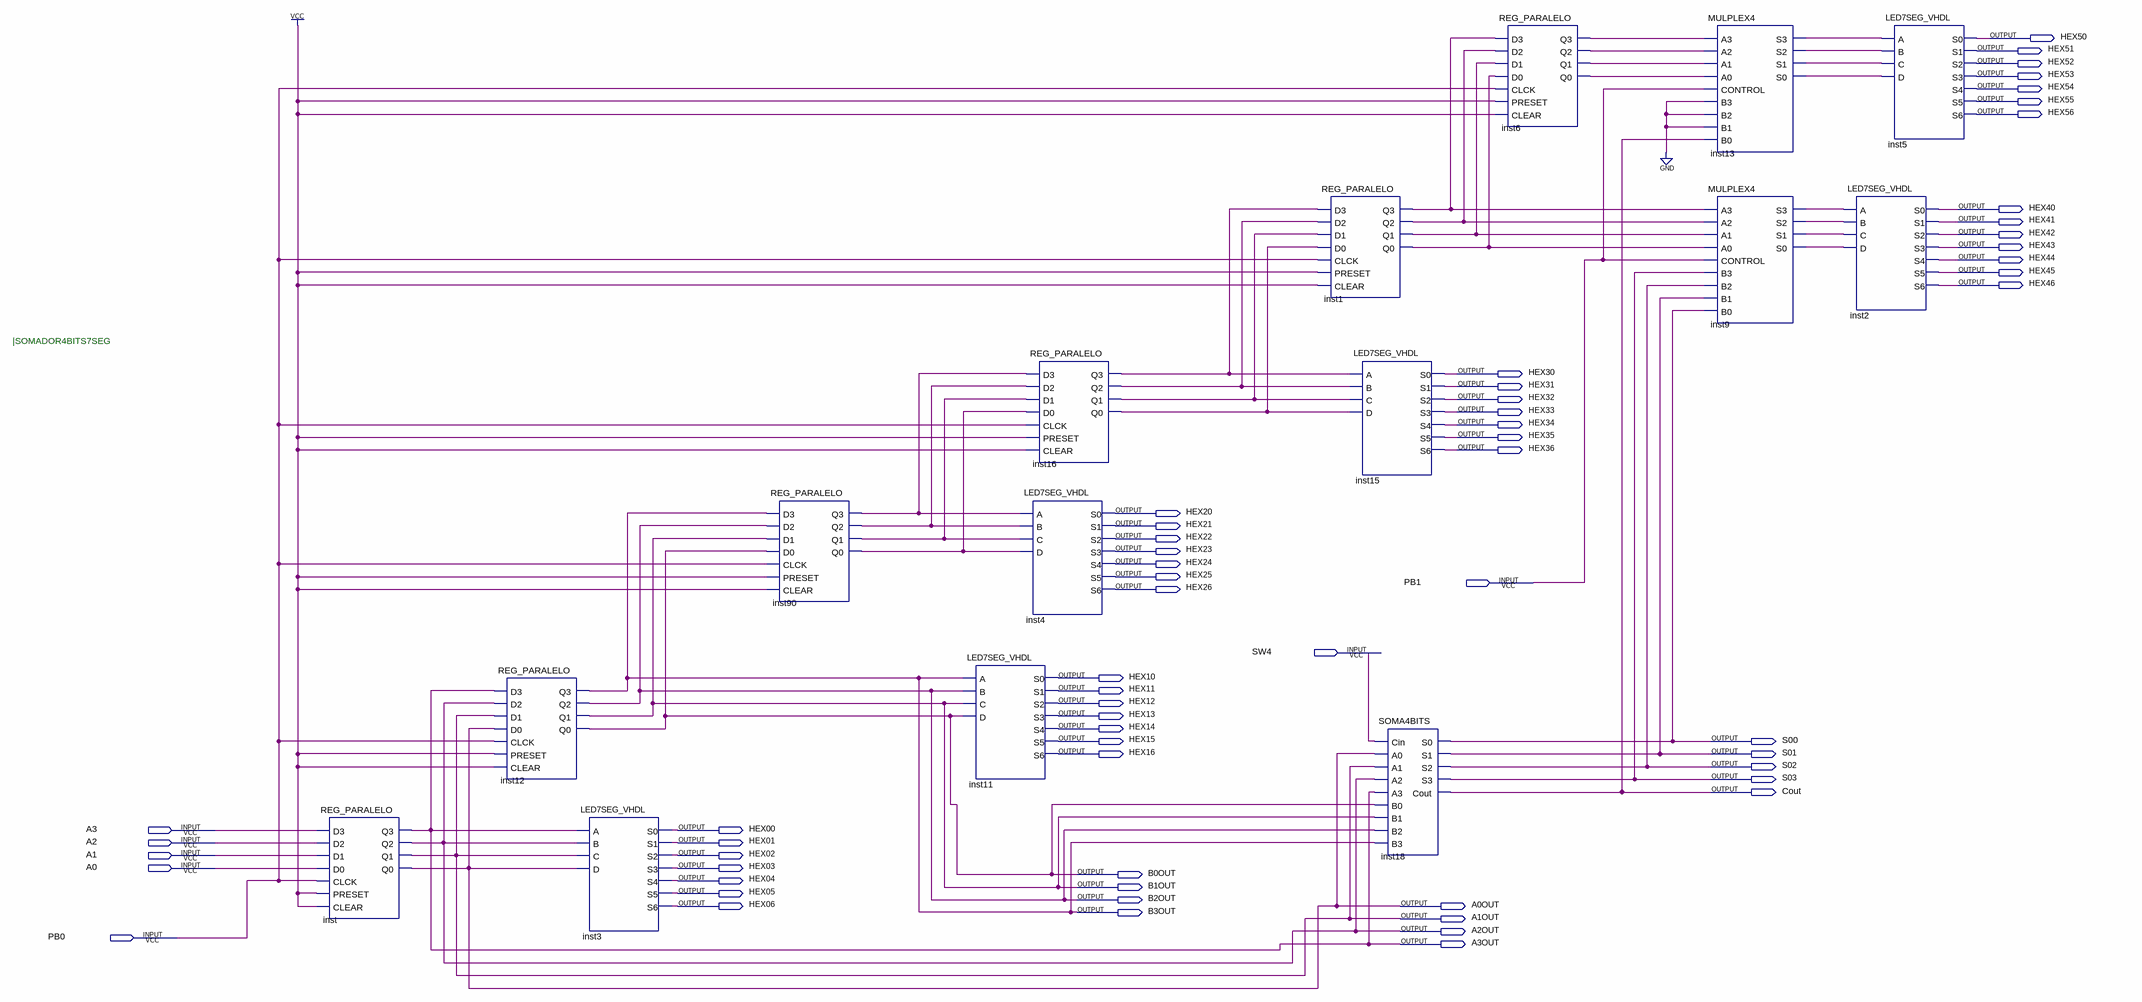
[diagram p0: schematic sheet]
// Quartus schematic SOMADOR4BITS7SEG.bdf as structural Verilog: 15 symbols, 62 pins
module SOMADOR4BITS7SEG (
  input  PB1,
  input  SW4,
  input  A3,
  input  A2,
  input  A1,
  input  A0,
  input  PB0,
  output HEX50,
  output HEX51,
  output HEX52,
  output HEX53,
  output HEX54,
  output HEX55,
  output HEX56,
  output HEX40,
  output HEX41,
  output HEX42,
  output HEX43,
  output HEX44,
  output HEX45,
  output HEX46,
  output HEX30,
  output HEX31,
  output HEX32,
  output HEX33,
  output HEX34,
  output HEX35,
  output HEX36,
  output HEX20,
  output HEX21,
  output HEX22,
  output HEX23,
  output HEX24,
  output HEX25,
  output HEX26,
  output HEX10,
  output HEX11,
  output HEX12,
  output HEX13,
  output HEX14,
  output HEX15,
  output S00,
  output HEX16,
  output S01,
  output S02,
  output S03,
  output Cout,
  output HEX00,
  output HEX01,
  output HEX02,
  output HEX03,
  output B0OUT,
  output HEX04,
  output B1OUT,
  output HEX05,
  output B2OUT,
  output HEX06,
  output A0OUT,
  output B3OUT,
  output A1OUT,
  output A2OUT,
  output A3OUT
);

  wire inst1_q0, inst1_q1, inst1_q2, inst1_q3, inst6_q0, inst6_q1, inst6_q2, inst6_q3, inst9_s0, inst9_s1,
       inst9_s2, inst9_s3, inst13_s0, inst13_s1, inst13_s2, inst13_s3, inst16_q0, inst16_q1, inst16_q2,
       inst16_q3, inst90_q0, inst90_q1, inst90_q2, inst90_q3;

  REG_PARALELO inst (
    .D3(A3), .D2(A2), .D1(A1), .D0(A0), .CLCK(PB0), .PRESET(1'b1), .CLEAR(1'b1), .Q3(A3OUT), .Q2(A2OUT),
    .Q1(A1OUT), .Q0(A0OUT));
  REG_PARALELO inst12 (
    .D3(A3OUT), .D2(A2OUT), .D1(A1OUT), .D0(A0OUT), .CLCK(PB0), .PRESET(1'b1), .CLEAR(1'b1), .Q3(B3OUT),
    .Q2(B2OUT), .Q1(B1OUT), .Q0(B0OUT));
  LED7SEG_VHDL inst3 (
    .A(A3OUT), .B(A2OUT), .C(A1OUT), .D(A0OUT), .S0(HEX00), .S1(HEX01), .S2(HEX02), .S3(HEX03), .S4(HEX04),
    .S5(HEX05), .S6(HEX06));
  REG_PARALELO inst90 (
    .D3(B3OUT), .D2(B2OUT), .D1(B1OUT), .D0(B0OUT), .CLCK(PB0), .PRESET(1'b1), .CLEAR(1'b1), .Q3(inst90_q3),
    .Q2(inst90_q2), .Q1(inst90_q1), .Q0(inst90_q0));
  LED7SEG_VHDL inst11 (
    .A(B3OUT), .B(B2OUT), .C(B1OUT), .D(B0OUT), .S0(HEX10), .S1(HEX11), .S2(HEX12), .S3(HEX13), .S4(HEX14),
    .S5(HEX15), .S6(HEX16));
  REG_PARALELO inst16 (
    .D3(inst90_q3), .D2(inst90_q2), .D1(inst90_q1), .D0(inst90_q0), .CLCK(PB0), .PRESET(1'b1), .CLEAR(1'b1),
    .Q3(inst16_q3), .Q2(inst16_q2), .Q1(inst16_q1), .Q0(inst16_q0));
  LED7SEG_VHDL inst4 (
    .A(inst90_q3), .B(inst90_q2), .C(inst90_q1), .D(inst90_q0), .S0(HEX20), .S1(HEX21), .S2(HEX22),
    .S3(HEX23), .S4(HEX24), .S5(HEX25), .S6(HEX26));
  REG_PARALELO inst1 (
    .D3(inst16_q3), .D2(inst16_q2), .D1(inst16_q1), .D0(inst16_q0), .CLCK(PB0), .PRESET(1'b1), .CLEAR(1'b1),
    .Q3(inst1_q3), .Q2(inst1_q2), .Q1(inst1_q1), .Q0(inst1_q0));
  LED7SEG_VHDL inst15 (
    .A(inst16_q3), .B(inst16_q2), .C(inst16_q1), .D(inst16_q0), .S0(HEX30), .S1(HEX31), .S2(HEX32),
    .S3(HEX33), .S4(HEX34), .S5(HEX35), .S6(HEX36));
  SOMA4BITS inst18 (
    .Cin(SW4), .A0(A0OUT), .A1(A1OUT), .A2(A2OUT), .A3(A3OUT), .B0(B0OUT), .B1(B1OUT), .B2(B2OUT),
    .B3(B3OUT), .S0(S00), .S1(S01), .S2(S02), .S3(S03), .Cout(Cout));
  REG_PARALELO inst6 (
    .D3(inst1_q3), .D2(inst1_q2), .D1(inst1_q1), .D0(inst1_q0), .CLCK(PB0), .PRESET(1'b1), .CLEAR(1'b1),
    .Q3(inst6_q3), .Q2(inst6_q2), .Q1(inst6_q1), .Q0(inst6_q0));
  MULPLEX4 inst13 (
    .A3(inst6_q3), .A2(inst6_q2), .A1(inst6_q1), .A0(inst6_q0), .CONTROL(PB1), .B3(1'b0), .B2(1'b0),
    .B1(1'b0), .B0(Cout), .S3(inst13_s3), .S2(inst13_s2), .S1(inst13_s1), .S0(inst13_s0));
  MULPLEX4 inst9 (
    .A3(inst1_q3), .A2(inst1_q2), .A1(inst1_q1), .A0(inst1_q0), .CONTROL(PB1), .B3(S03), .B2(S02), .B1(S01),
    .B0(S00), .S3(inst9_s3), .S2(inst9_s2), .S1(inst9_s1), .S0(inst9_s0));
  LED7SEG_VHDL inst2 (
    .A(inst9_s3), .B(inst9_s2), .C(inst9_s1), .D(inst9_s0), .S0(HEX40), .S1(HEX41), .S2(HEX42), .S3(HEX43),
    .S4(HEX44), .S5(HEX45), .S6(HEX46));
  LED7SEG_VHDL inst5 (
    .A(inst13_s3), .B(inst13_s2), .C(inst13_s1), .D(inst13_s0), .S0(HEX50), .S1(HEX51), .S2(HEX52),
    .S3(HEX53), .S4(HEX54), .S5(HEX55), .S6(HEX56));

  // Notes on the sheet:
  //   |SOMADOR4BITS7SEG
endmodule
